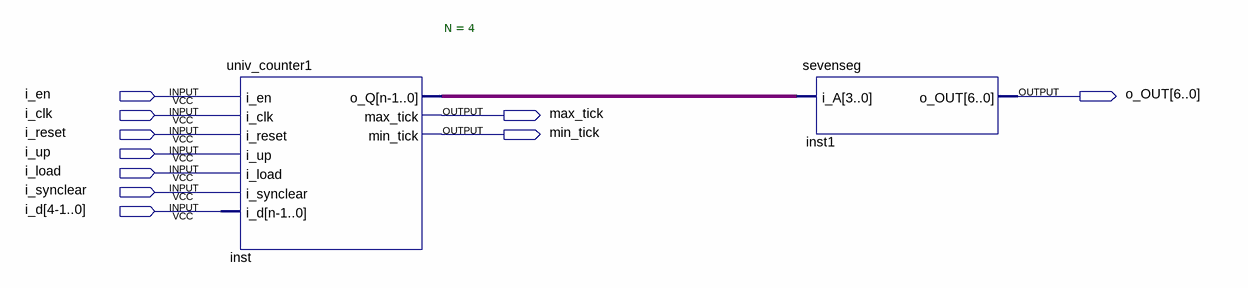
[diagram p0: schematic sheet]
// Quartus schematic lab8c.bdf as structural Verilog: 2 symbols, 10 pins
module lab8c (
  input  i_en,
  input  i_clk,
  input  i_reset,
  input  i_up,
  input  i_load,
  input  i_synclear,
  input  \i_d[4-1..0] ,
  output [6:0] o_OUT,
  output max_tick,
  output min_tick
);

  wire [3:0] inst_o_q;

  univ_counter1 #(.N(4)) inst (
    .i_en(i_en), .i_clk(i_clk), .i_reset(i_reset), .i_up(i_up), .i_load(i_load), .i_synclear(i_synclear),
    .i_d({4{\i_d[4-1..0] }}), .o_Q(inst_o_q), .max_tick(max_tick), .min_tick(min_tick));
  sevenseg inst1 (.i_A(inst_o_q), .o_OUT(o_OUT));
endmodule
